# EAGLE schematic untitled (EAGLE 6.1)
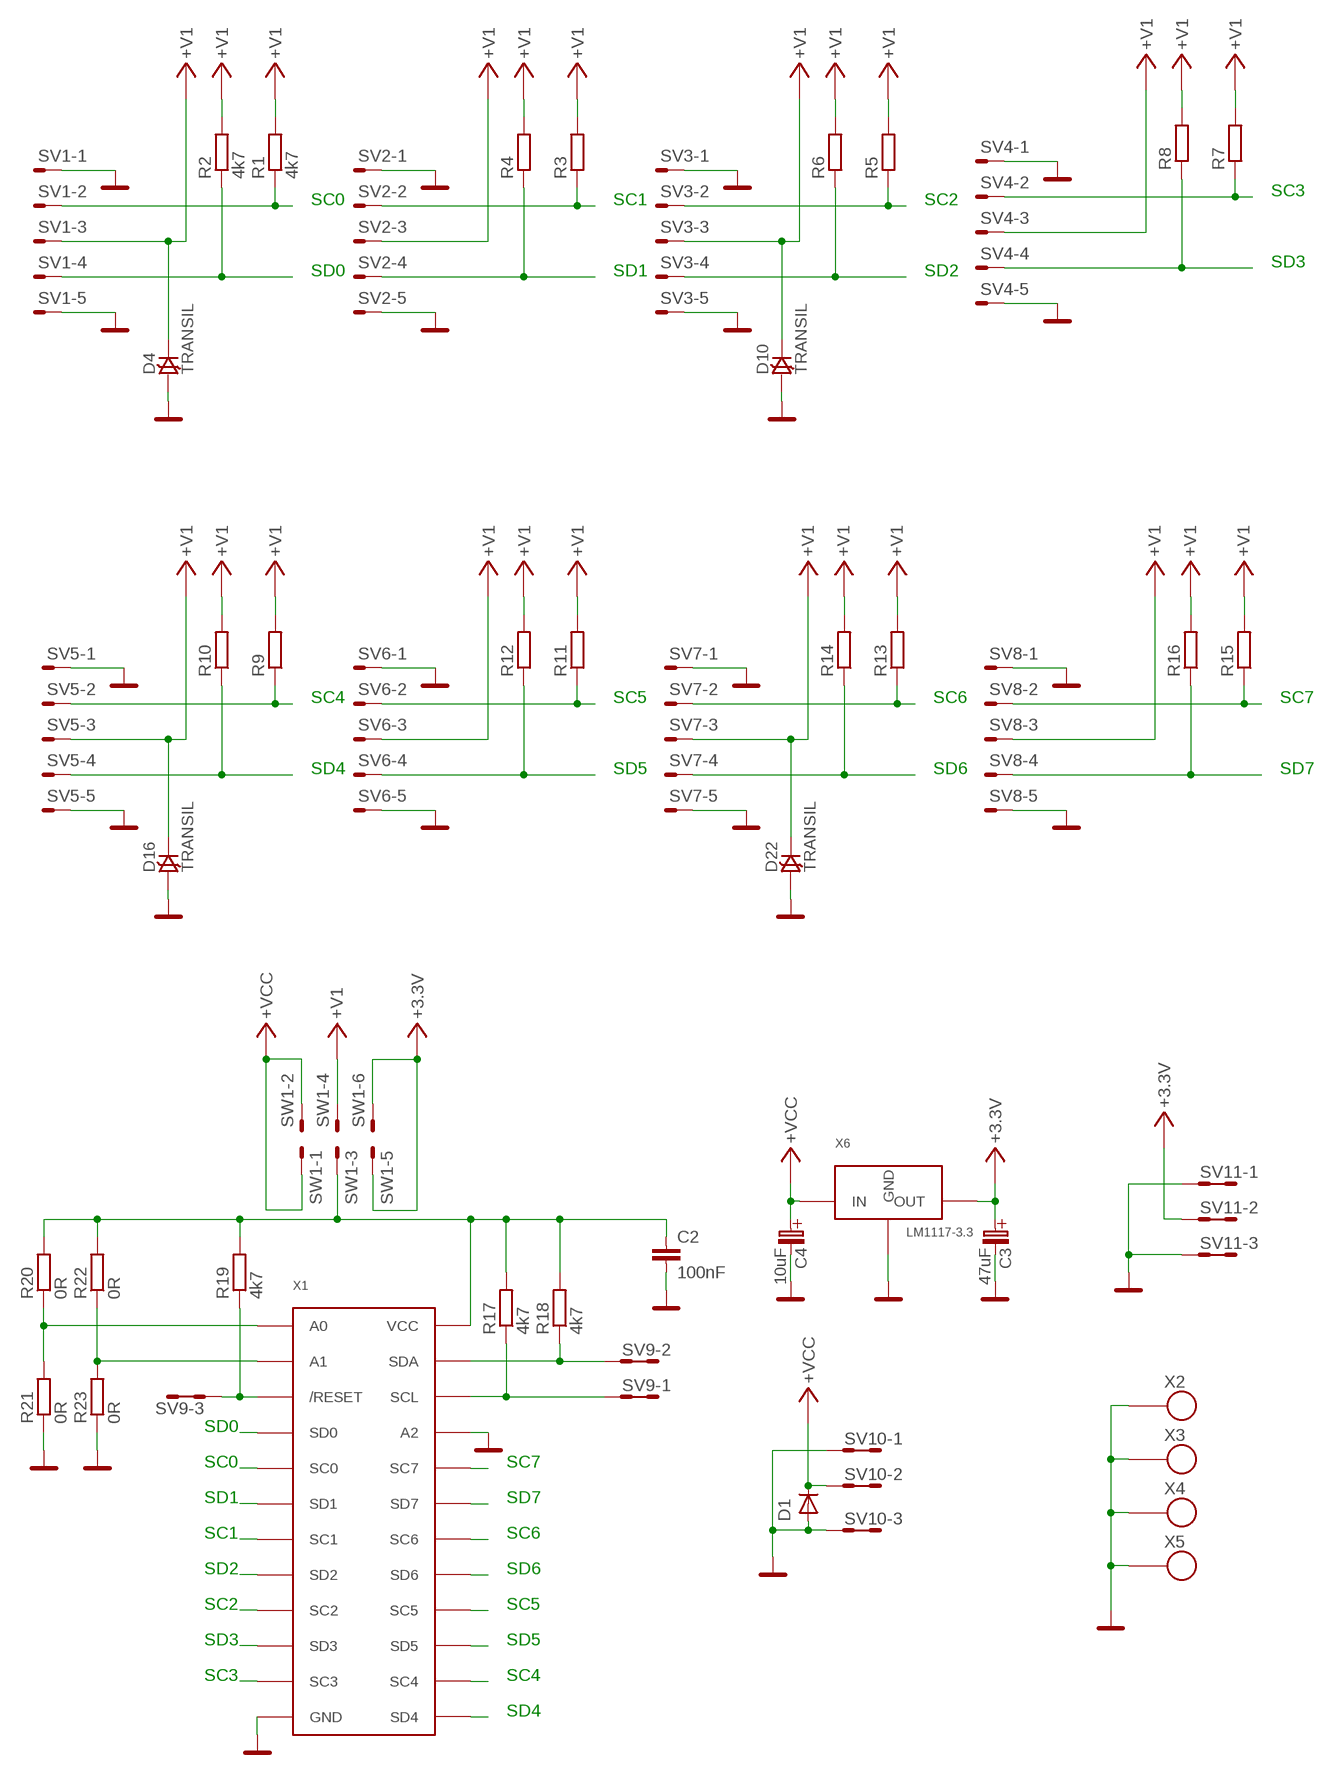
[diagram p0: schematic, sheet 1]

## Parts
C2  100nF  C0805  [C0805]
C3  47uF  C  [C]
C4  10uF  B  [B]
D1  D-OB.SMA  [SMA]
D4  TRANSIL  D-TRANSIL-SMA  [SMA]
D10  TRANSIL  D-TRANSIL-SMA  [SMA]
D16  TRANSIL  D-TRANSIL-SMA  [SMA]
D22  TRANSIL  D-TRANSIL-SMA  [SMA]
R1  4k7  R0805  [0805]
R2  4k7  R0805  [0805]
R3  R0805  [0805]
R4  R0805  [0805]
R5  R0805  [0805]
R6  R0805  [0805]
R7  R0805  [0805]
R8  R0805  [0805]
R9  R0805  [0805]
R10  R0805  [0805]
R11  R0805  [0805]
R12  R0805  [0805]
R13  R0805  [0805]
R14  R0805  [0805]
R15  R0805  [0805]
R16  R0805  [0805]
R17  4k7  R0805  [0805]
R18  4k7  R0805  [0805]
R19  4k7  R0805  [0805]
R20  0R  R0805  [0805]
R21  0R  R0805  [0805]
R22  0R  R0805  [0805]
R23  0R  R0805  [0805]
SV1  MA05-1  [MA05-1]
SV2  MA05-1  [MA05-1]
SV3  MA05-1  [MA05-1]
SV4  MA05-1  [MA05-1]
SV5  MA05-1  [MA05-1]
SV6  MA05-1  [MA05-1]
SV7  MA05-1  [MA05-1]
SV8  MA05-1  [MA05-1]
SV9  MA03-2  [MA03-2]
SV10  MA03-2  [MA03-2]
SV11  MA03-2  [MA03-2]
SW1  MA03-3  [MA03-2]
X1  TCA9548A  [TSS0P24]
X2  SROUB3M  [SROUB3M]
X3  SROUB3M  [SROUB3M]
X4  SROUB3M  [SROUB3M]
X5  SROUB3M  [SROUB3M]
X6  LM1117-3.3  LM1117  [SOT223]

## Nets
+3.3V: C3.+(C_EL+) SV11.3 SV11.4 SW1.5 SW1.6 X6.2(OUT) X6.4(OUT)
+V1: D4.K D10.K D16.K D22.K R1.2 R2.2 R3.2 R4.2 R5.2 R6.2 R7.2 R8.2 R9.2 R10.2 R11.2 R12.2 R13.2 R14.2 R15.2 R16.2 SV1.3 SV2.3 SV3.3 SV4.3 SV5.3 SV6.3 SV7.3 SV8.3 SW1.4
+VCC: C4.+(C_EL+) D1.K(C) SV10.3 SV10.4 SW1.1 SW1.2 X6.3(IN)
/RESET: R19.1 SV9.5 SV9.6 X1.3(/RESET)
GND: C2.2 C3.-(C_EL-) C4.-(C_EL-) D1.A D4.A D10.A D16.A D22.A R21.1 R23.1 SV1.1 SV1.5 SV2.1 SV2.5 SV3.1 SV3.5 SV4.1 SV4.5 SV5.1 SV5.5 SV6.1 SV6.5 SV7.1 SV7.5 SV8.1 SV8.5 SV10.1 SV10.2 SV10.5 SV10.6 SV11.1 SV11.2 SV11.5 SV11.6 X1.12(GND) X1.21(A2) X2.P$1 X3.P$1 X4.P$1 X5.P$1 X6.1(GND)
N$5: C2.1 R17.2 R18.2 R19.2 R20.2 R22.2 SW1.3 X1.24(VCC)
N$20: R20.1 R21.2 X1.1(A0)
N$22: R22.1 R23.2 X1.2(A1)
SC0: R1.1 SV1.2 X1.5(SC0)
SC1: R3.1 SV2.2 X1.7(SC1)
SC2: R5.1 SV3.2 X1.9(SC2)
SC3: R7.1 SV4.2 X1.11(SC3)
SC4: R9.1 SV5.2 X1.14(SC4)
SC5: R11.1 SV6.2 X1.16(SC5)
SC6: R13.1 SV7.2 X1.18(SC6)
SC7: R15.1 SV8.2 X1.20(SC7)
SCL: R17.1 SV9.1 SV9.2 X1.22(SCL)
SD0: R2.1 SV1.4 X1.4(SD0)
SD1: R4.1 SV2.4 X1.6(SD1)
SD2: R6.1 SV3.4 X1.8(SD2)
SD3: R8.1 SV4.4 X1.10(SD3)
SD4: R10.1 SV5.4 X1.13(SD4)
SD5: R12.1 SV6.4 X1.15(SD5)
SD6: R14.1 SV7.4 X1.17(SD6)
SD7: R16.1 SV8.4 X1.19(SD7)
SDA: R18.1 SV9.3 SV9.4 X1.23(SDA)

## Notes on the sheet
- SC3
- SC0 | SC1 | SC2
- SD3
- SD0 | SD1 | SD2
- SC4 | SC5 | SC6 | SC7
- SD4 | SD5 | SD6 | SD7
- SD0
- SC0 | SC7
- SD1 | SD7
- SC1 | SC6
- SD2 | SD6
- SC2 | SC5
- SD3 | SD5
- SC3 | SC4
- SD4

## Library data of the parts
C2 = moje_C:C0805
C3 = moje_C:C
C4 = moje_C:B
D1 = moje:D-OB.SMA: SMA
D4 D10 D16 D22 = moje_diody:D-TRANSIL-SMA
R1-R23 = moje_R:R0805
SV1-SV8 = moje_hrebinky:MA05-1: PIN HEADER; OC_FARNELL: unknown; OC_NEWARK: unknown
SV9-SV11 = moje_hrebinky:MA03-2: PIN HEADER; OC_FARNELL: unknown; OC_NEWARK: unknown
SW1 = moje_hrebinky:MA03-3
X1 = moje_io:TCA9548A: I2C HUB TSSOP24
X2-X5 = moje:SROUB3M
X6 = moje_stabil:LM1117: STABILIZATOR LM1117